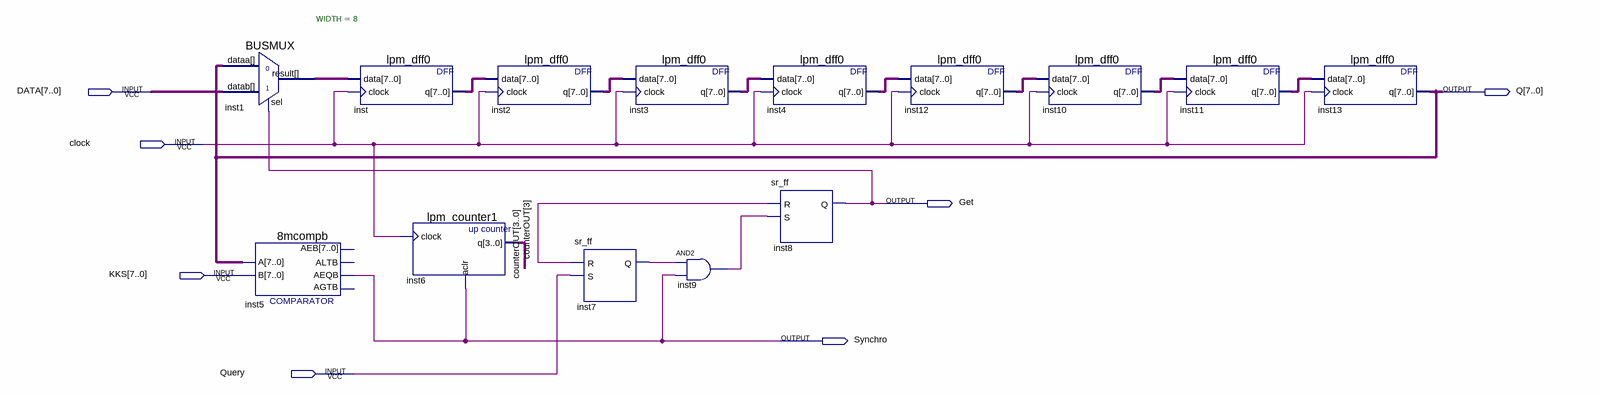
[diagram p0: schematic sheet]
// Quartus schematic laba1.bdf as structural Verilog: 14 symbols, 7 pins
module laba1 (
  input  [7:0] DATA,
  input  clock,
  input  [7:0] KKS,
  input  Query,
  output [7:0] Q,
  output Get,
  output Synchro
);

  wire inst7_q, inst9_out;
  wire [3:0] counterOUT;
  wire [7:0] inst1_result, inst2_q, inst3_q, inst4_q, inst10_q, inst11_q, inst12_q, inst_q;

  BUSMUX #(.WIDTH(8)) inst1 (.datab(DATA), .sel(Get), .dataa(Q), .result(inst1_result));
  \8mcompb  inst5 (.B(KKS), .A(Q), .AEQB(Synchro));  // open: AEB, AGTB, ALTB
  lpm_dff0 inst (.data(inst1_result), .clock(clock), .q(inst_q));
  lpm_counter1 inst6 (.clock(clock), .aclr(Synchro), .q(counterOUT));
  lpm_dff0 inst2 (.data(inst_q), .clock(clock), .q(inst2_q));
  sr_ff inst7 (.R(counterOUT[3]), .S(Query), .Q(inst7_q));
  lpm_dff0 inst3 (.data(inst2_q), .clock(clock), .q(inst3_q));
  and inst9 (inst9_out, inst7_q, Synchro);
  lpm_dff0 inst4 (.data(inst3_q), .clock(clock), .q(inst4_q));
  sr_ff inst8 (.R(counterOUT[3]), .S(inst9_out), .Q(Get));
  lpm_dff0 inst12 (.data(inst4_q), .clock(clock), .q(inst12_q));
  lpm_dff0 inst10 (.data(inst12_q), .clock(clock), .q(inst10_q));
  lpm_dff0 inst11 (.data(inst10_q), .clock(clock), .q(inst11_q));
  lpm_dff0 inst13 (.data(inst11_q), .clock(clock), .q(Q));
endmodule
